# EAGLE design MyRIO_LickometerBreakout_Gamma1a (EAGLE 8.2.0)

## Sheet 1 of 2
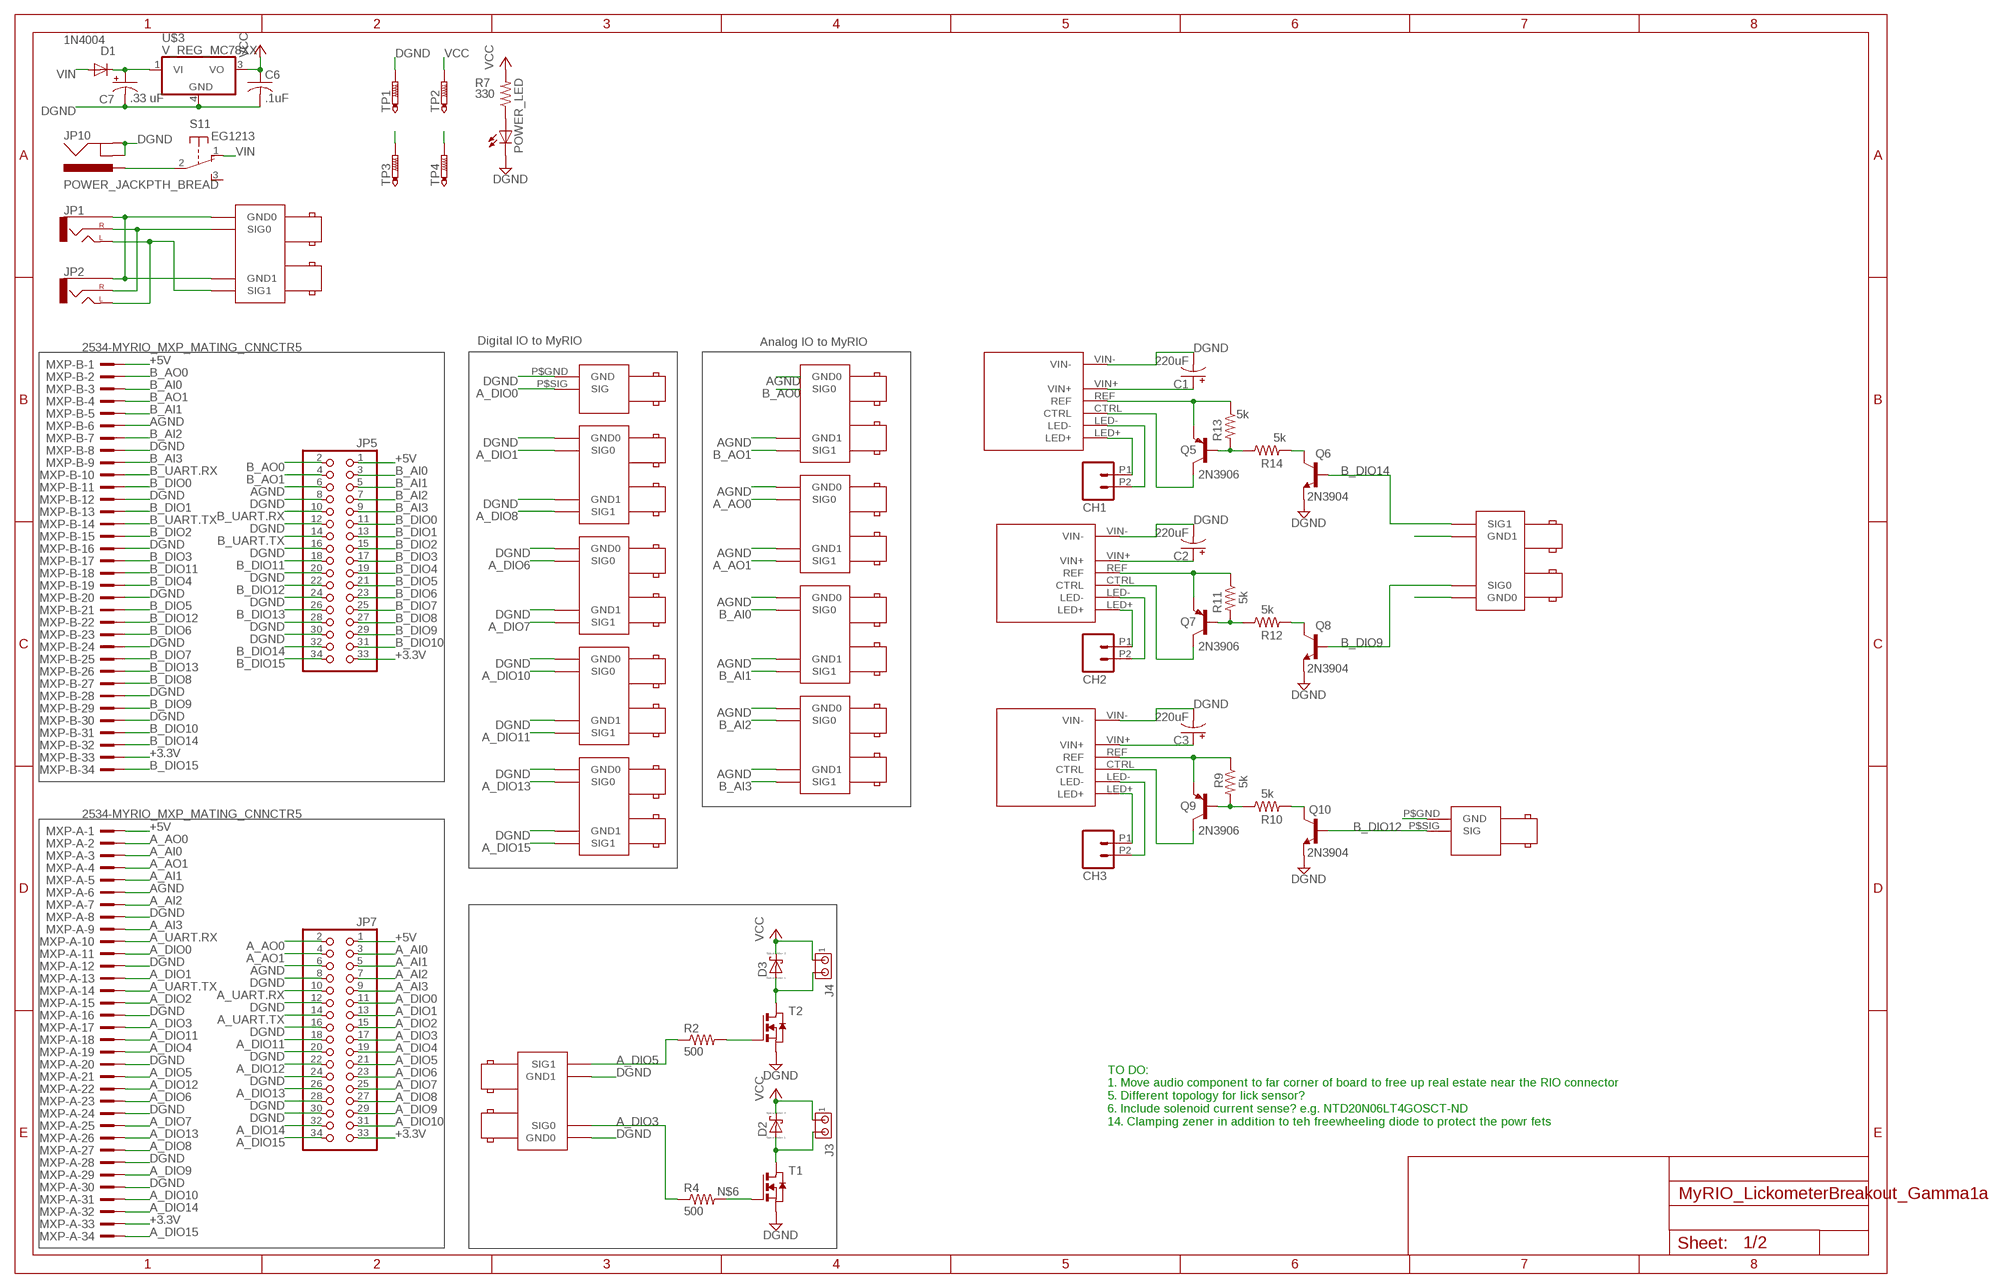
[diagram p0: schematic, sheet 1]

### Parts
AAO_0,1  BNC_RIGHT_ANGLE_DOUBLE  [BNC_RIGHT_ANGLE_DOUBLE]
ACTV_REC  BNC_RIGHT_ANGLE  [BNC_RIGHT_ANGLE]
AUDIO  BNC_RIGHT_ANGLE_DOUBLE  [BNC_RIGHT_ANGLE_DOUBLE]
BAI_0,1  BNC_RIGHT_ANGLE_DOUBLE  [BNC_RIGHT_ANGLE_DOUBLE]
BAI_2,3  BNC_RIGHT_ANGLE_DOUBLE  [BNC_RIGHT_ANGLE_DOUBLE]
BAO_0,1  BNC_RIGHT_ANGLE_DOUBLE  [BNC_RIGHT_ANGLE_DOUBLE]
BUCKPUCK1  BUCKPUCK-350-I  [BUCKPUCK_I]
BUCKPUCK2  BUCKPUCK-350-I  [BUCKPUCK_I]
BUCKPUCK3  BUCKPUCK-350-I  [BUCKPUCK_I]
C1  220uF  CPOL-USE5-10.5  [E5-10,5]
C2  220uF  CPOL-USE5-10.5  [E5-10,5]
C3  220uF  CPOL-USE5-10.5  [E5-10,5]
C6  .1uF  C-USC0805  [C0805]
C7  .33 uF  CPOL-USE2.5-5  [E2,5-5]
CAMERA  BNC_RIGHT_ANGLE_DOUBLE  [BNC_RIGHT_ANGLE_DOUBLE]
CH1  M022.54MM_SCREWTERM  [1X02_2.54_SCREWTERM]
CH2  M022.54MM_SCREWTERM  [1X02_2.54_SCREWTERM]
CH3  M022.54MM_SCREWTERM  [1X02_2.54_SCREWTERM]
D1  1N4004  [DO41-10]
D2  SCHOTTKY-DIODE  [DIODE_SMB]
D3  SCHOTTKY-DIODE  [DIODE_SMB]
D_FREE1_2  BNC_RIGHT_ANGLE_DOUBLE  [BNC_RIGHT_ANGLE_DOUBLE]
D_FREE3_4  BNC_RIGHT_ANGLE_DOUBLE  [BNC_RIGHT_ANGLE_DOUBLE]
J3  MTA02-100  [10X02MTA]
J4  MTA02-100  [10X02MTA]
JP1  AUDIO-JACKPTH  [AUDIO-JACK]
JP2  AUDIO-JACKPTH  [AUDIO-JACK]
JP5  PINHD-2X17  [2X17]
JP7  PINHD-2X17  [2X17]
JP10  POWER_JACKPTH_BREAD  [POWER_JACK_PTH_BREAD]
LED_CUE  BNC_RIGHT_ANGLE  [BNC_RIGHT_ANGLE]
LED_MASK  BNC_RIGHT_ANGLE_DOUBLE  [BNC_RIGHT_ANGLE_DOUBLE]
MXP-A  2534-MYRIO_MXP_MATING_CNNCTR5  [PAK100/2500-5-34-MXP_CONNCTR]
MXP-B  2534-MYRIO_MXP_MATING_CNNCTR5  [PAK100/2500-5-34-MXP_CONNCTR]
POWER_LED  LED3MM  [LED3MM]
Q5  2N3906  MMBT3906LT1-PNP-SOT23-BEC  [SOT23-BEC]
Q6  2N3904  MMBT3904LT1-NPN-SOT23-BEC  [SOT23-BEC]
Q7  2N3906  MMBT3906LT1-PNP-SOT23-BEC  [SOT23-BEC]
Q8  2N3904  MMBT3904LT1-NPN-SOT23-BEC  [SOT23-BEC]
Q9  2N3906  MMBT3906LT1-PNP-SOT23-BEC  [SOT23-BEC]
Q10  2N3904  MMBT3904LT1-NPN-SOT23-BEC  [SOT23-BEC]
R2  500  R-US_M1206  [M1206]
R4  500  R-US_M1206  [M1206]
R7  330  RESISTOR_SM0805S  [0805S]
R9  5k  RESISTOR_SM0805S  [0805S]
R10  5k  RESISTOR_SM0805S  [0805S]
R11  5k  RESISTOR_SM0805S  [0805S]
R12  5k  RESISTOR_SM0805S  [0805S]
R13  5k  RESISTOR_SM0805S  [0805S]
R14  5k  RESISTOR_SM0805S  [0805S]
S1  EG1213  [EG1213]
SHUTTER  BNC_RIGHT_ANGLE_DOUBLE  [BNC_RIGHT_ANGLE_DOUBLE]
SLN  BNC_RIGHT_ANGLE_DOUBLE  [BNC_RIGHT_ANGLE_DOUBLE]
T1  NMOSSOT223  [SOT223]
T2  NMOSSOT223  [SOT223]
TP1  PTR1PAD1-17Y  [P1-17Y]
TP2  PTR1PAD1-17Y  [P1-17Y]
TP3  PTR1PAD1-17Y  [P1-17Y]
TP4  PTR1PAD1-17Y  [P1-17Y]
U$3  V_REG_MC78XX  [DPAK]

### Nets
+3.3V: JP5.33 JP7.33 MXP-A.33 MXP-B.33
+5V: JP5.1 JP7.1 MXP-A.1 MXP-B.1 ; also sheet 2
+9V: TP4.TP ; also sheet 2
A_AI0: JP7.3 MXP-A.3
A_AI1: JP7.5 MXP-A.5
A_AI2: JP7.7 MXP-A.7
A_AI3: JP7.9 MXP-A.9
A_AO0: AAO_0,1.P$SIG0(SIG0) JP7.2 MXP-A.2
A_AO1: AAO_0,1.P$SIG1(SIG1) JP7.4 MXP-A.4
A_DIO0: ACTV_REC.P$SIG(SIG) JP7.11 MXP-A.11
A_DIO1: CAMERA.P$SIG0(SIG0) JP7.13 MXP-A.13
A_DIO2: JP7.15 MXP-A.15 ; also sheet 2
A_DIO3: JP7.17 MXP-A.17 R4.1 SLN.P$SIG0(SIG0)
A_DIO4: JP7.19 MXP-A.19 ; also sheet 2
A_DIO5: JP7.21 MXP-A.21 R2.1 SLN.P$SIG1(SIG1)
A_DIO6: JP7.23 MXP-A.23 SHUTTER.P$SIG0(SIG0)
A_DIO7: JP7.25 MXP-A.25 SHUTTER.P$SIG1(SIG1)
A_DIO8: CAMERA.P$SIG1(SIG1) JP7.27 MXP-A.27
A_DIO9: JP7.29 MXP-A.29
A_DIO10: D_FREE1_2.P$SIG0(SIG0) JP7.31 MXP-A.31
A_DIO11: D_FREE1_2.P$SIG1(SIG1) JP7.18 MXP-A.18
A_DIO12: JP7.22 MXP-A.22
A_DIO13: D_FREE3_4.P$SIG0(SIG0) JP7.26 MXP-A.26
A_DIO14: JP7.32 MXP-A.32
A_DIO15: D_FREE3_4.P$SIG1(SIG1) JP7.34 MXP-A.34
A_UART.RX: JP7.10 MXP-A.10
A_UART.TX: JP7.14 MXP-A.14
AGND: AAO_0,1.P$GND0(GND0) AAO_0,1.P$GND1(GND1) BAI_0,1.P$GND0(GND0) BAI_0,1.P$GND1(GND1) BAI_2,3.P$GND0(GND0) BAI_2,3.P$GND1(GND1) BAO_0,1.P$GND0(GND0) BAO_0,1.P$GND1(GND1) JP5.6 JP7.6 MXP-A.6 MXP-B.6
B_AI0: BAI_0,1.P$SIG0(SIG0) JP5.3 MXP-B.3
B_AI1: BAI_0,1.P$SIG1(SIG1) JP5.5 MXP-B.5
B_AI2: BAI_2,3.P$SIG0(SIG0) JP5.7 MXP-B.7
B_AI3: BAI_2,3.P$SIG1(SIG1) JP5.9 MXP-B.9
B_AO0: BAO_0,1.P$SIG0(SIG0) JP5.2 MXP-B.2
B_AO1: BAO_0,1.P$SIG1(SIG1) JP5.4 MXP-B.4
B_DIO0: JP5.11 MXP-B.11
B_DIO1: JP5.13 MXP-B.13
B_DIO2: JP5.15 MXP-B.15
B_DIO3: JP5.17 MXP-B.17
B_DIO4: JP5.19 MXP-B.19
B_DIO5: JP5.21 MXP-B.21
B_DIO6: JP5.23 MXP-B.23
B_DIO7: JP5.25 MXP-B.25
B_DIO8: JP5.27 MXP-B.27
B_DIO9: JP5.29 LED_MASK.P$SIG0(SIG0) MXP-B.29 Q8.B
B_DIO10: JP5.31 MXP-B.31
B_DIO11: JP5.18 MXP-B.18
B_DIO12: JP5.22 LED_CUE.P$SIG(SIG) MXP-B.22 Q10.B
B_DIO13: JP5.26 MXP-B.26
B_DIO14: JP5.32 LED_MASK.P$SIG1(SIG1) MXP-B.32 Q6.B
B_DIO15: JP5.34 MXP-B.34
B_UART.RX: JP5.10 MXP-B.10
B_UART.TX: JP5.14 MXP-B.14
BCKPCK_CTRL2: Q8.C R12.2
BCKPCK_CTRL3: Q10.C R10.2
CTRL1: BUCKPUCK1.CTRL Q5.C
CTRL2: BUCKPUCK2.CTRL Q7.C
CTRL3: BUCKPUCK3.CTRL Q9.C
DGND: ACTV_REC.P$GND(GND) BUCKPUCK1.LED- BUCKPUCK1.VIN- BUCKPUCK2.LED- BUCKPUCK2.VIN- BUCKPUCK3.LED- BUCKPUCK3.VIN- C1.- C2.- C3.- C6.2 C7.- CAMERA.P$GND0(GND0) CAMERA.P$GND1(GND1) CH1.P2 CH2.P2 CH3.P2 D_FREE1_2.P$GND0(GND0) D_FREE1_2.P$GND1(GND1) D_FREE3_4.P$GND0(GND0) D_FREE3_4.P$GND1(GND1) JP5.8 JP5.12 JP5.16 JP5.20 JP5.24 JP5.28 JP5.30 JP7.8 JP7.12 JP7.16 JP7.20 JP7.24 JP7.28 JP7.30 JP10.GND JP10.GNDBREAK LED_CUE.P$GND(GND) LED_MASK.P$GND0(GND0) LED_MASK.P$GND1(GND1) MXP-A.8 MXP-A.12 MXP-A.16 MXP-A.20 MXP-A.24 MXP-A.28 MXP-A.30 MXP-B.8 MXP-B.12 MXP-B.16 MXP-B.20 MXP-B.24 MXP-B.28 MXP-B.30 POWER_LED.K(C) Q6.E Q8.E Q10.E SHUTTER.P$GND0(GND0) SHUTTER.P$GND1(GND1) SLN.P$GND0(GND0) SLN.P$GND1(GND1) T1.3(S) T2.3(S) TP1.TP U$3.4(GND) ; also sheet 2
GND-ISO: TP3.TP ; also sheet 2
LED3+: BUCKPUCK3.LED+ CH3.P1
N$2: R2.2 T2.1(G)
N$3: AUDIO.P$GND0(GND0) AUDIO.P$GND1(GND1) JP1.SLEEVE JP2.SLEEVE
N$4: AUDIO.P$SIG0(SIG0) JP1.RING(RIGHT) JP2.RING(RIGHT)
N$5: AUDIO.P$SIG1(SIG1) JP1.TIP(LEFT) JP2.TIP(LEFT)
N$6: R4.2 T1.1(G)
N$11: BUCKPUCK3.REF Q9.E R9.1
N$13: BUCKPUCK1.LED+ CH1.P1
N$15: Q9.B R9.2 R10.1
N$16: BUCKPUCK1.VIN+ BUCKPUCK2.VIN+ BUCKPUCK3.VIN+ C1.+ C2.+ C3.+ C7.+ D1.C U$3.1(VI)
N$20: BUCKPUCK2.LED+ CH2.P1
N$21: POWER_LED.A R7.1
N$22: BUCKPUCK1.REF Q5.E R13.1
N$24: BUCKPUCK2.REF Q7.E R11.1
N$29: Q5.B R13.2 R14.1
N$33: Q7.B R11.2 R12.1
N$36: JP10.PWR S1.2(1:P)
N$42: Q6.C R14.2
VCC: C6.1 D2.C(A) D3.C(A) J3.1 J4.1 R7.2 TP2.TP U$3.3(VO)
VIN: D1.A S1.1(1:O)
VOUT-1: D2.A(C) J3.2 T1.2(D) T1.4(D)
VOUT-2: D3.A(C) J4.2 T2.2(D) T2.4(D)
Unconnected: S1.3(1:S) S1.MT1(MT) S1.MT2(MT)

### Notes on the sheet
- Digital IO to MyRIO | Analog IO to MyRIO
- TO DO:
  1. Move audio component to far corner of board to free up real estate near the RIO connector
  5. Different topology for lick sensor?
  6. Include solenoid current sense? e.g. NTD20N06LT4GOSCT-ND
  14. Clamping zener in addition to teh freewheeling diode to protect the powr fets

## Sheet 2 of 2
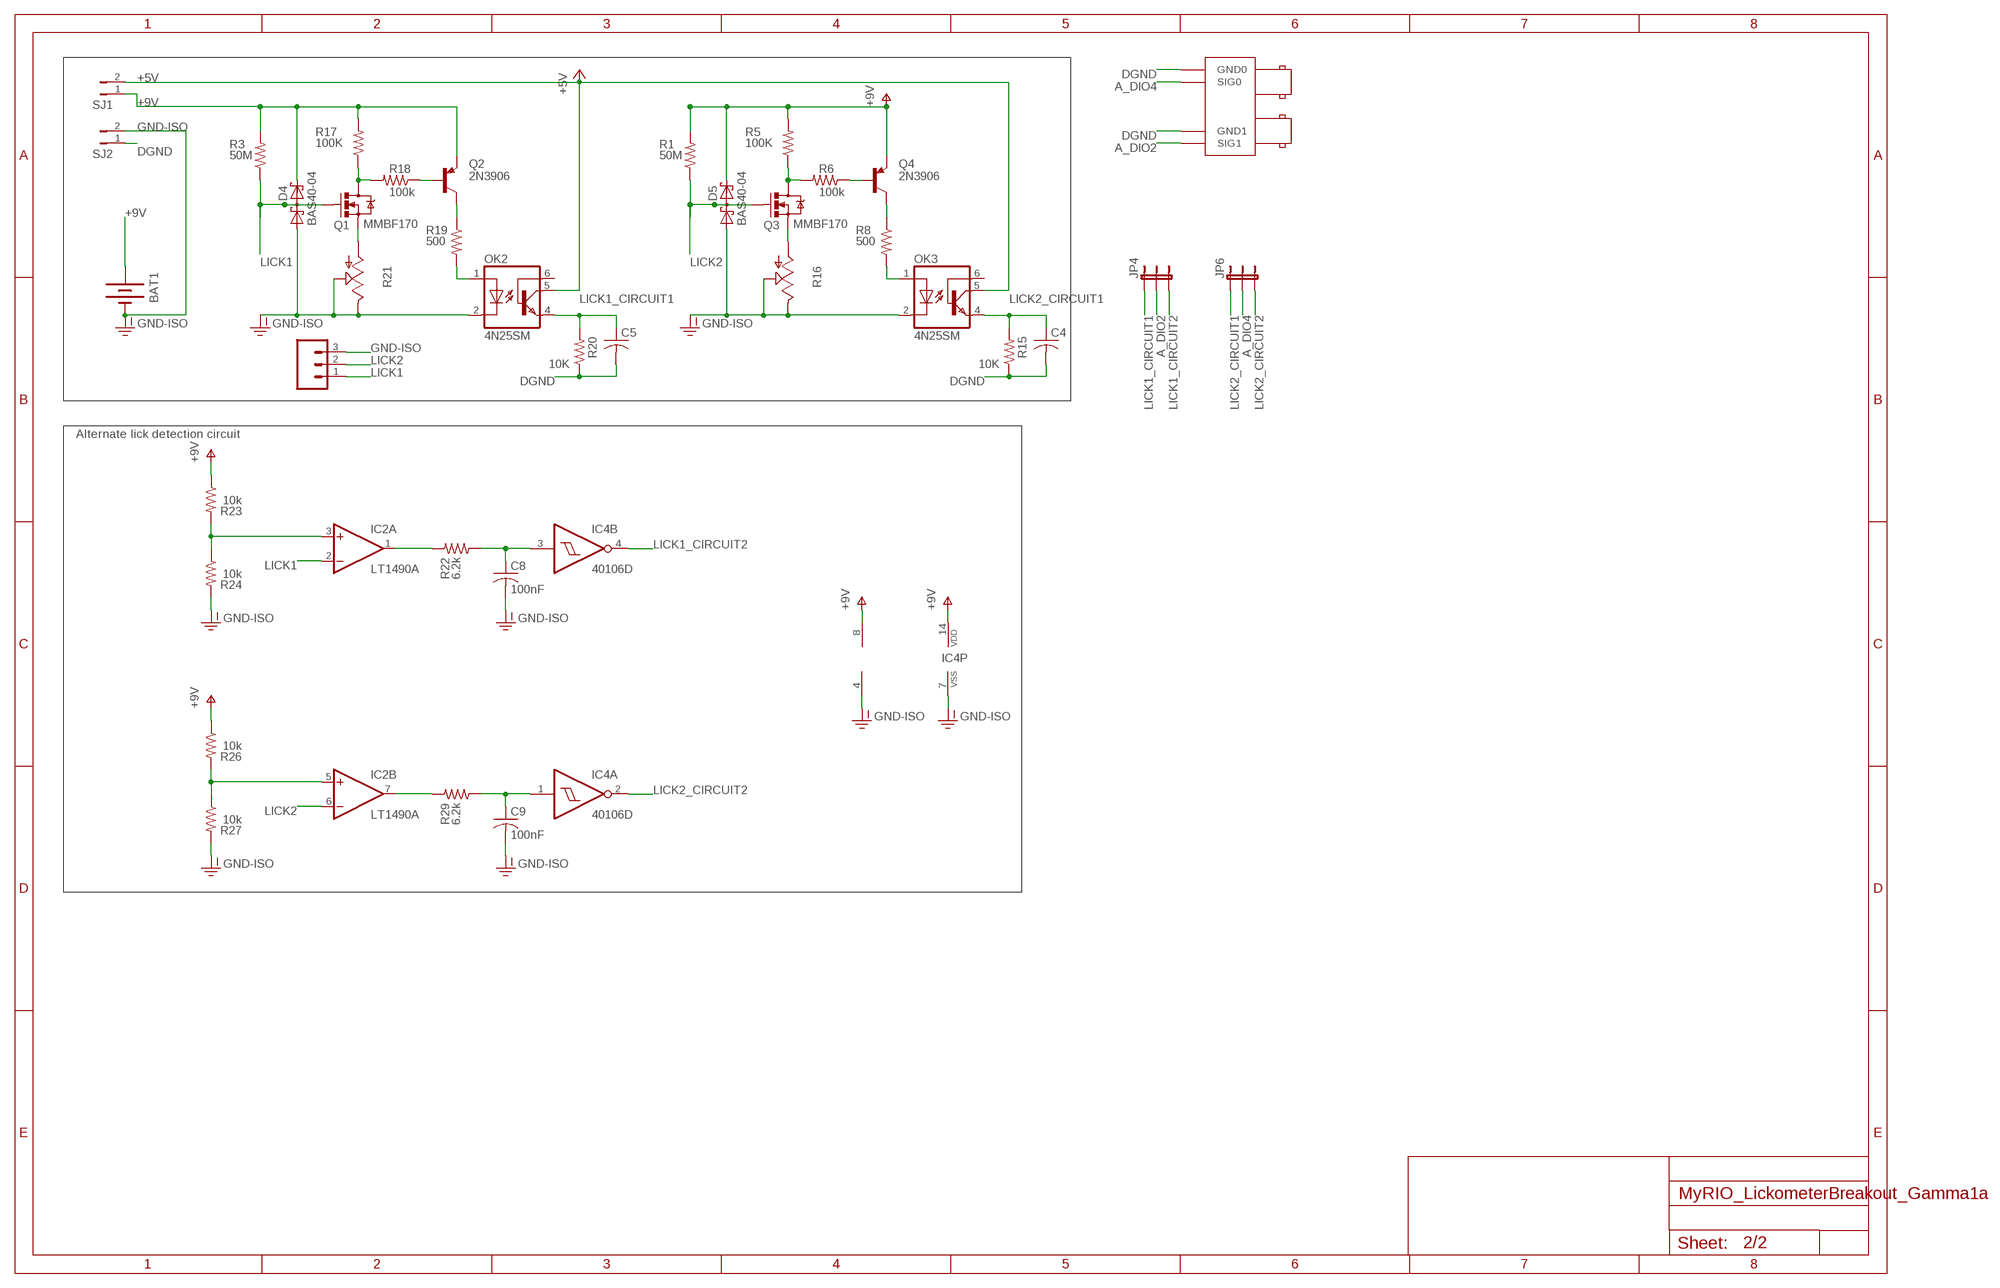
[diagram p1: schematic, sheet 2]

### Parts
BAT1  BATTERY9V  [BATTCON_9V]
C4  C-US025-024X044  [C025-024X044]
C5  C-US025-024X044  [C025-024X044]
C8  100nF  C-USC0805  [C0805]
C9  100nF  C-USC0805  [C0805]
D4  BAS40-04  [SOT23]
D5  BAS40-04  [SOT23]
IC2  LT1490A  LM393D  [SO08]
IC4  40106D  [SO14]
JP4  JUMPER-3PTH  [1X03]
JP6  JUMPER-3PTH  [1X03]
JP11  M03POLAR  [MOLEX-1X3]
LICK  BNC_RIGHT_ANGLE_DOUBLE  [BNC_RIGHT_ANGLE_DOUBLE]
OK2  4N25SM  [DIL6-SMD]
OK3  4N25SM  [DIL6-SMD]
Q1  MMBF170  MOSFET-NCHANNELAO3404A  [SOT23-3]
Q2  2N3906  MMBT3906LT1-PNP-SOT23-BEC  [SOT23-BEC]
Q3  MMBF170  MOSFET-NCHANNELAO3404A  [SOT23-3]
Q4  2N3906  MMBT3906LT1-PNP-SOT23-BEC  [SOT23-BEC]
R1  50M  RESISTOR_SM0805S  [0805S]
R3  50M  RESISTOR_SM0805S  [0805S]
R5  100K  RESISTOR_SM0805S  [0805S]
R6  100k  RESISTOR_SM0805S  [0805S]
R8  500  RESISTOR_SM0805S  [0805S]
R15  10K  RESISTOR_SM0805S  [0805S]
R16  TRIM_US-B25P  [B25P]
R17  100K  RESISTOR_SM0805S  [0805S]
R18  100k  RESISTOR_SM0805S  [0805S]
R19  500  RESISTOR_SM0805S  [0805S]
R20  10K  RESISTOR_SM0805S  [0805S]
R21  TRIM_US-B25P  [B25P]
R22  6.2k  RESISTOR_SM0805S  [0805S]
R23  10k  RESISTOR_SM0805S  [0805S]
R24  10k  RESISTOR_SM0805S  [0805S]
R26  10k  RESISTOR_SM0805S  [0805S]
R27  10k  RESISTOR_SM0805S  [0805S]
R29  6.2k  RESISTOR_SM0805S  [0805S]
SJ1  JUMPER-PTH-2-NO  [PTH-JUMPER-2-NO_NO_SILK]
SJ2  JUMPER-PTH-2-NO  [PTH-JUMPER-2-NO_NO_SILK]

### Nets
+5V: OK2.5(COL) OK3.5(COL) SJ1.2 ; also sheet 1
+9V: BAT1.+ D4.2(C2) D5.2(C2) IC2.8(P:V+) IC4.14(P:VDD) Q2.E Q4.E R1.2 R3.2 R5.2 R17.2 R23.1 R26.1 SJ1.1 ; also sheet 1
A_DIO2: JP4.2 LICK.P$SIG1(SIG1) ; also sheet 1
A_DIO4: JP6.2 LICK.P$SIG0(SIG0) ; also sheet 1
DGND: C4.2 C5.2 LICK.P$GND0(GND0) LICK.P$GND1(GND1) R15.1 R20.1 SJ2.1 ; also sheet 1
GND-ISO: BAT1.- C8.2 C9.2 D4.1(A1) D5.1(A1) IC2.4(P:V-) IC4.7(P:VSS) JP11.3 OK2.2(C) OK3.2(C) R16.E R16.S R21.E R21.S R24.2 R27.2 SJ2.2 ; also sheet 1
LICK1: D4.3(C1A2) IC2.2(A:-IN) JP11.1 Q1.1(G) R3.1
LICK1_CIRCUIT1: C5.1 JP4.1 OK2.4(EMI) R20.2
LICK1_CIRCUIT2: IC4.4(B:O) JP4.3
LICK2: D5.3(C1A2) IC2.6(B:-IN) JP11.2 Q3.1(G) R1.1
LICK2_CIRCUIT1: C4.1 JP6.1 OK3.4(EMI) R15.2
LICK2_CIRCUIT2: IC4.2(A:O) JP6.3
N$1: Q1.3(D) R17.1 R18.2
N$7: Q3.3(D) R5.1 R6.2
N$8: Q4.B R6.1
N$9: OK3.1(A) R8.2
N$10: Q4.C R8.1
N$12: Q3.2(S) R16.A
N$14: Q2.B R18.1
N$17: OK2.1(A) R19.2
N$18: Q2.C R19.1
N$19: Q1.2(S) R21.A
N$23: C8.1 IC4.3(B:I) R22.1
N$25: IC2.1(A:OUT) R22.2
N$26: IC2.3(A:+IN) R23.2 R24.1
N$31: IC2.5(B:+IN) R26.2 R27.1
N$34: C9.1 IC4.1(A:I) R29.1
N$35: IC2.7(B:OUT) R29.2
Unconnected: IC4.5(C:I) IC4.6(C:O) IC4.8(D:O) IC4.9(D:I) IC4.10(E:O) IC4.11(E:I) IC4.12(F:O) IC4.13(F:I) OK2.6(BAS) OK3.6(BAS)

### Notes on the sheet
- Alternate lick detection circuit

## Library data of the parts
AAO_0,1 AUDIO BAI_0,1 BAI_2,3 BAO_0,1 CAMERA D_FREE1_2 D_FREE3_4 LED_MASK LICK SHUTTER SLN = Pavel_Connectors:BNC_RIGHT_ANGLE_DOUBLE
ACTV_REC LED_CUE = connectors:BNC_RIGHT_ANGLE: BNC plug, through-hole, right-angle
BAT1 = Pavel_ElectroMechanical:BATTERY: Battery Holders Various common sizes : AA, AAA, 18650 (PRT-12895), 20mm coin cell and 12mm coin cell. 20MM_4LEGS, BATT-10373 9V Digikey BH9v-PC-ND
BUCKPUCK1-BUCKPUCK3 = Pavel-PowerIC:BUCKPUCK-*-?
C1-C3 C7 = adafruit:CPOL-US: POLARIZED CAPACITOR, American symbol
C4-C6 C8 C9 = adafruit:C-US: CAPACITOR, American symbol
CH1-CH3 = SparkFun-Connectors:M02: Standard 2-pin 0.1" header. Use with - straight break away headers ( PRT-00116) - right angle break away headers (PRT-00553) - swiss pins (PRT-00743) - machine pins (PRT-00117) - female headers (PRT-00115) Molex polarized connector foot print use with: PRT-08233 with associated crimp pins and housings. 2.54_SCREWTERM for use with PRT-10571. 3.5mm Screw Terminal footprints for PRT-08084 5mm Screw Terminal footprints for use with PRT-08432
D1 = adafruit:1N4004: DIODE General purpose 1N400x type rectifier (With bigger pads) http://www.ladyada.net/library/pcb/eaglelibrary.html
D2 D3 = eagle-ltspice:SCHOTTKY-DIODE: Schottky Diode; SPICEMODEL: NONE; SPICEPREFIX: D; SPICETYPE: diode
D4 D5 = diode:BAS40-04: Silicon Schottky Diodes General-purpose diode for high-speed switching
IC2 = linear:LM393: COMPARATOR
IC4 = 40xx:40106: Hex SCHMITT TRIGGER
J3 J4 = con-amp:MTA02-100: AMP connector
JP1 JP2 = SparkFun-Connectors:AUDIO-JACK: 3.5mm Audio Jack Simple 3.5mm common PCB mount audio jack. Variant PTH is our storefront SKU PRT-08032
JP4 JP6 = SparkFun-Retired:JUMPER-3
JP5 JP7 = pinhead:PINHD-2X17: PIN HEADER
JP10 = SparkFun-Connectors:POWER_JACK: Power Jack Connector This is the standard 5.5mm barrel jack for power. The PTH is the most common, proven, reliable, footprint. The Slot footprint only works if the mill layer is transmitted to the PCB fab house so be warned. Here are the connectors we sell at SparkFun: DC Barrel Power Jack/Connector <https://www.sparkfun.com/products/119> (PRT-00119) DC Barrel Power Jack/Connector (SMD) <https://www.sparkfun.com/products/12748> (PRT-12748) DC Barrel Jack Adapter - Breadboard Compatible <https://www.sparkfun.com/products/10811> (PRT-10811) It is used on this SparkFun product (and many, many others): SparkFun RedBoard - Programmed with Arduino <https://www.sparkfun.com/products/12757> (DEV-12757) Also, if you need a mating power supply or connector, please check these out: Wall Adapter Power Supply - 9VDC 650mA <https://www.sparkfun.com/products/298> (TOL-00298) DC Barrel Jack Adapter - Male <https://www.sparkfun.com/products/10287> (PRT-10287); PROD_ID: PRT-10811
JP11 = SparkFun:M03: Header 3 Standard 3-pin 0.1" header. Use with straight break away headers (SKU : PRT-00116), right angle break away headers (PRT-00553), swiss pins (PRT-00743), machine pins (PRT-00117), and female headers (PRT-00115). Molex polarized connector foot print use with SKU : PRT-08232 with associated crimp pins and housings.
MXP-A MXP-B = Pavel_ElectroMechanical:2534-MYRIO_MXP_MATING_CNNCTR: 3M (TM) Pak 100 4-Wall Header Source: 3M; OC_FARNELL: 9838406; OC_NEWARK: unknown
OK2 OK3 = optocoupler:4N*?M: General Purpose 6-Pin Phototransistor Optocouplers Source: http://www.fairchildsemi.com/ds/4N/4N35-M.pdf; MF: FAIRCHILD SEMICONDUCTOR; MPN: 4N25SM; OC_FARNELL: 1021152; OC_NEWARK: 34C2020
POWER_LED = led:LED: LED OSRAM: - CHIPLED LG R971, LG N971, LY N971, LG Q971, LY Q971, LO R971, LY R971 LH N974, LH R974 LS Q976, LO Q976, LY Q976 LO Q996 - Hyper CHIPLED LW Q18S LB Q993, LB Q99A, LB R99A - SideLED LS A670, LO A670, LY A670, LG A670, LP A670 LB A673, LV A673, LT A673, LW A673 LH A674 LY A675 LS A676, LA A676, LO A676, LY A676, LW A676 LS A679, LY A679, LG A679 - Hyper Micro SIDELED® LS Y876, LA Y876, LO Y876, LY Y876 LT Y87S - SmartLED LW L88C, LW L88S LB L89C, LB L89S, LG L890 LS L89K, LO L89K, LY L89K LS L896, LA L896, LO L896, LY L896 - TOPLED LS T670, LO T670, LY T670, LG T670, LP T670 LSG T670, LSP T670, LSY T670, LOP T670, LYG T670 LG T671, LOG T671, LSG T671 LB T673, LV T673, LT T673, LW T673 LH T674 LS T676, LA T676, LO T676, LY T676, LB T676, LH T676, LSB T676, LW T676 LB T67C, LV T67C, LT T67C, LS T67K, LO T67K, LY T67K, LW E67C LS E67B, LA E67B, LO E67B, LY E67B, LB E67C, LV E67C, LT E67C LW T67C LS T679, LY T679, LG T679 LS T770, LO T770, LY T770, LG T770, LP T770 LB T773, LV T773, LT T773, LW T773 LH T774 LS E675, LA E675, LY E675, LS T675 LS T776, LA T776, LO T776, LY T776, LB T776 LHGB T686 LT T68C, LB T68C - Hyper Mini TOPLED® LB M676 - Mini TOPLED Santana® LG M470 LS M47K, LO M47K, LY M47K Source: http://www.osram.convergy.de LUXEON: - LUMILED® LXK2-PW12-R00, LXK2-PW12-S00, LXK2-PW14-U00, LXK2-PW14-V00 LXK2-PM12-R00, LXK2-PM12-S00, LXK2-PM14-U00 LXK2-PE12-Q00, LXK2-PE12-R00, LXK2-PE12-S00, LXK2-PE14-T00, LXK2-PE14-U00 LXK2-PB12-K00, LXK2-PB12-L00, LXK2-PB12-M00, LXK2-PB14-N00, LXK2-PB14-P00, LXK2-PB14-Q00 LXK2-PR12-L00, LXK2-PR12-M00, LXK2-PR14-Q00, LXK2-PR14-R00 LXK2-PD12-Q00, LXK2-PD12-R00, LXK2-PD12-S00 LXK2-PH12-R00, LXK2-PH12-S00 LXK2-PL12-P00, LXK2-PL12-Q00, LXK2-PL12-R00 Source: www.luxeon.com KINGBRIGHT: KA-3528ASYC Source: www.kingbright.com
Q1 Q3 = SparkFun-DiscreteSemi:MOSFET-NCHANNEL: Common NMOSFET Parts MFG P/N Store ID Prod ID FDD8780 TRANS-09984 SI7820DN TRANS-11055 FDS6630A IC-08089 2N7002PW TRANS-11151 FQP30N06L COM-10213 TRANS-10060 BSS123LT1G TRANS-08345 BSS138 TRANS-00830 BS170 2N7000; PROD_ID: TRAN-12988
Q2 Q4 Q5 Q7 Q9 = transistor:*-PNP-: PNP Transistror
Q6 Q8 Q10 = transistor-neu-to92:*-NPN-: NPN Transistror
R1 R3 R5-R15 R17-R20 R22-R24 R26 R27 R29 = SteveS:RESISTOR_SM
R2 R4 = adafruit:R-US_: RESISTOR, American symbol
R16 R21 = pot:TRIM_US-: POTENTIOMETER
S1 = adafruit:EG1213: E-Switch right-angle slide SPDT Part #EG1213 http://www.ladyada.net/library/eagle
SJ1 SJ2 = SparkFun-Passives:JUMPER-PTH-2-NO
T1 T2 = zetex:NMOSSOT223: MOS FET; OC_FARNELL: unknown; OC_NEWARK: unknown
TP1-TP4 = testpad:PTR1: TEST PIN
U$3 = Pavel-PowerIC:V_REG_MC78XX: DigiKey MC7815BD2TR4GOSDKR-ND TO-263-3, D2Pak, TO-263AB http://www.digikey.com/product-detail/en/MC7815BD2TR4G/MC7815BD2TR4GOSDKR-ND/3462629

## Net classes
1 power: width 0.508 mm

## Board
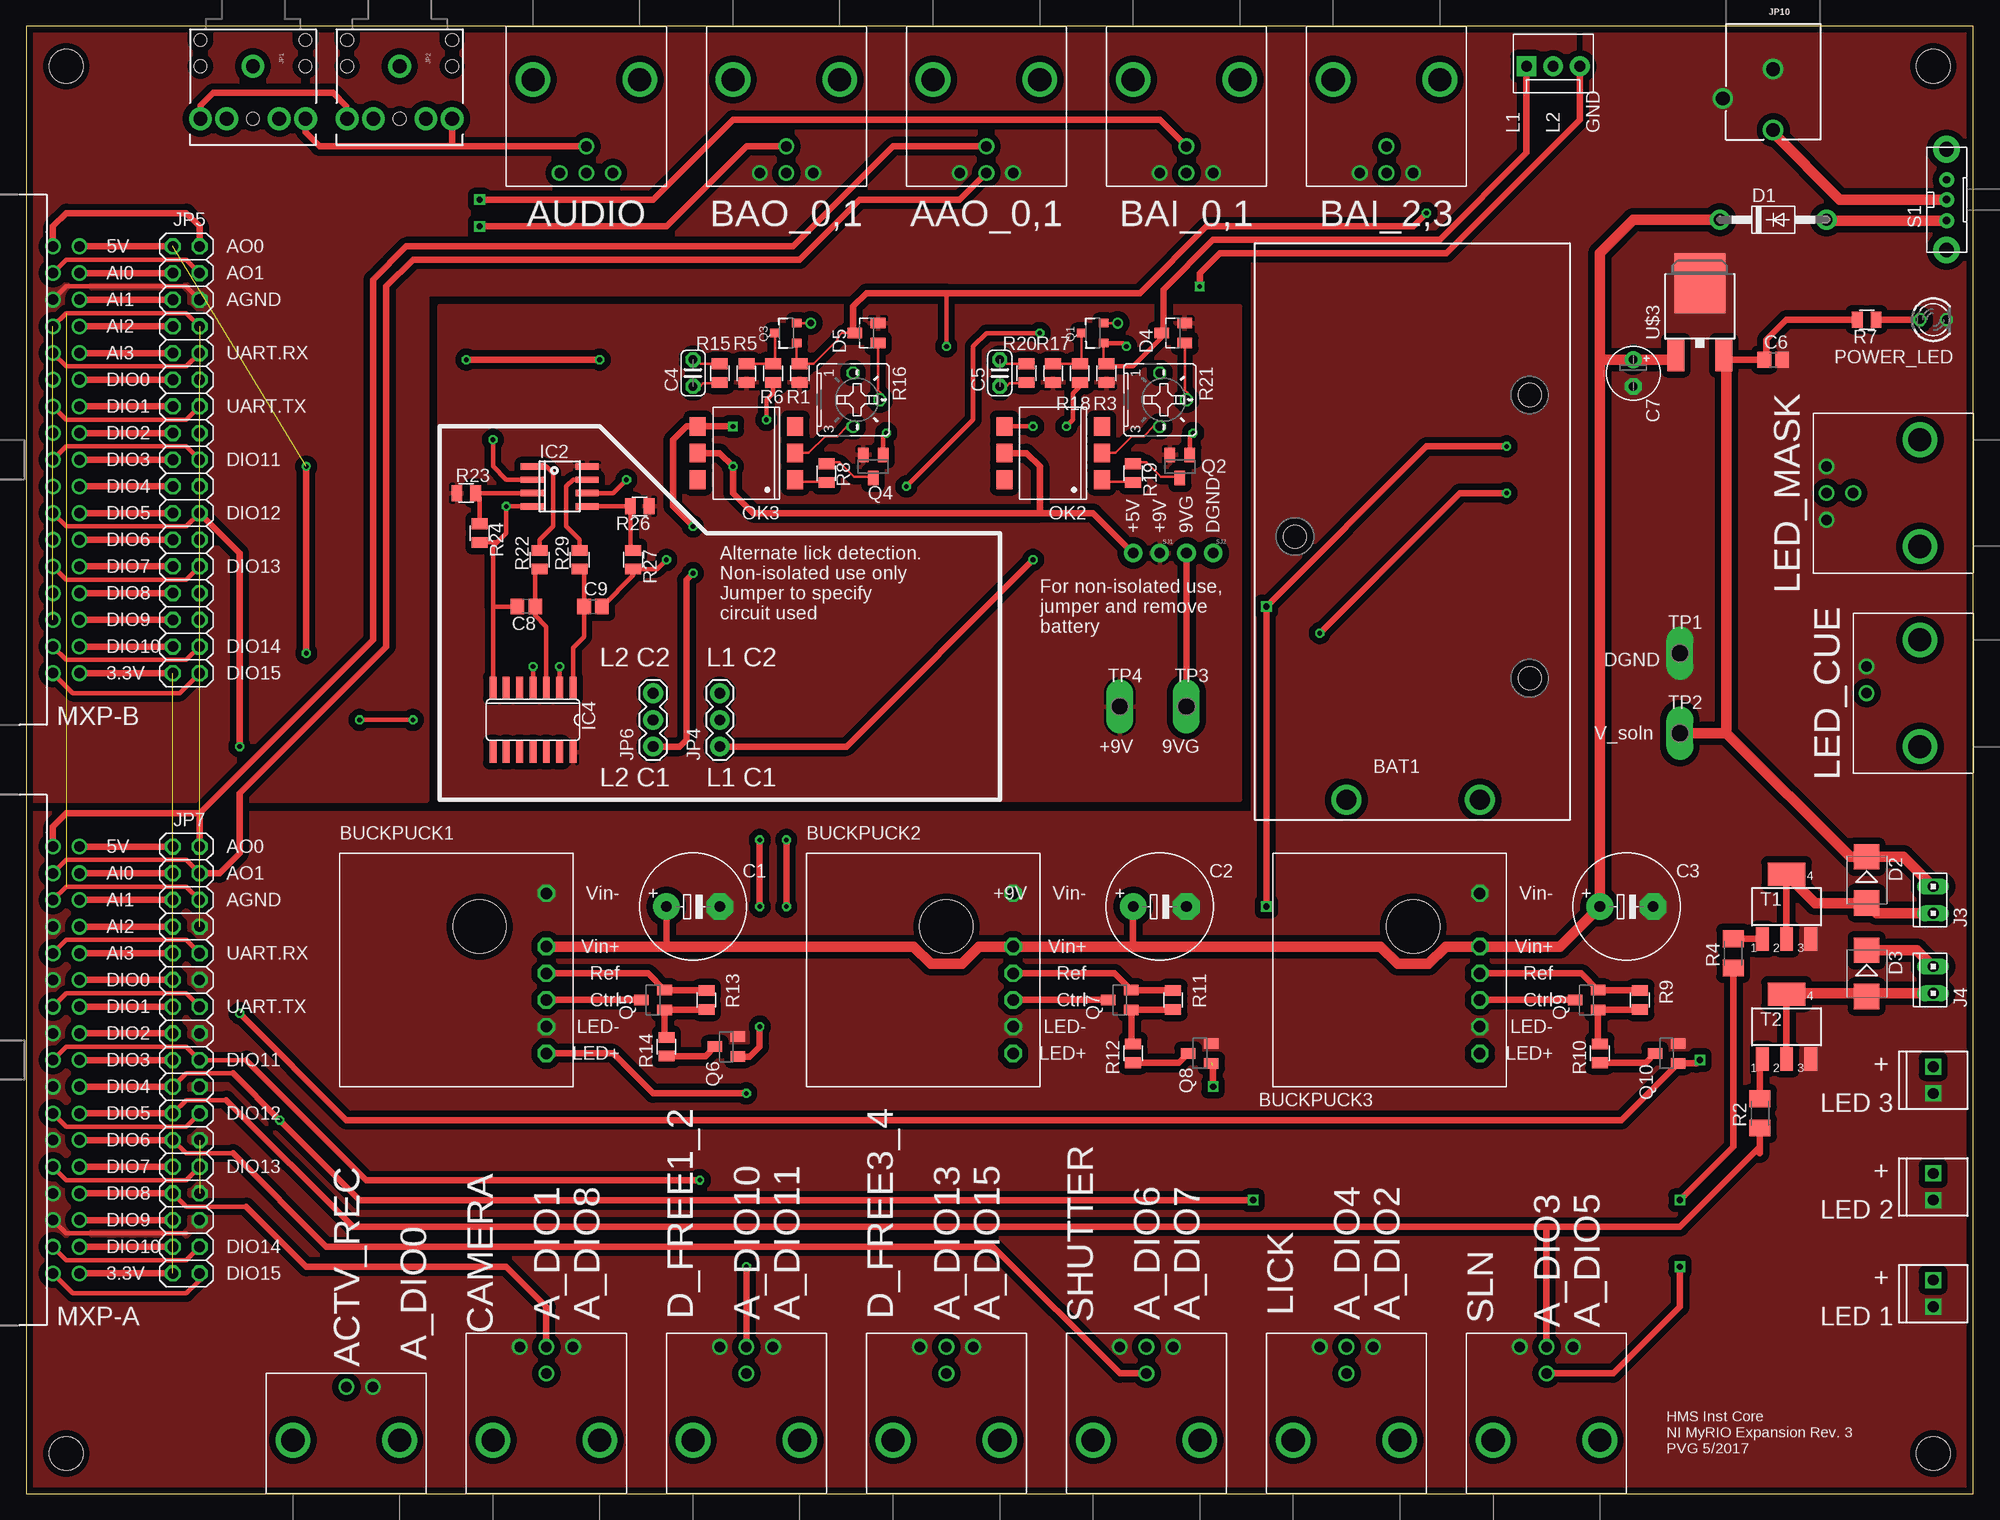
[diagram p2: board, top side]
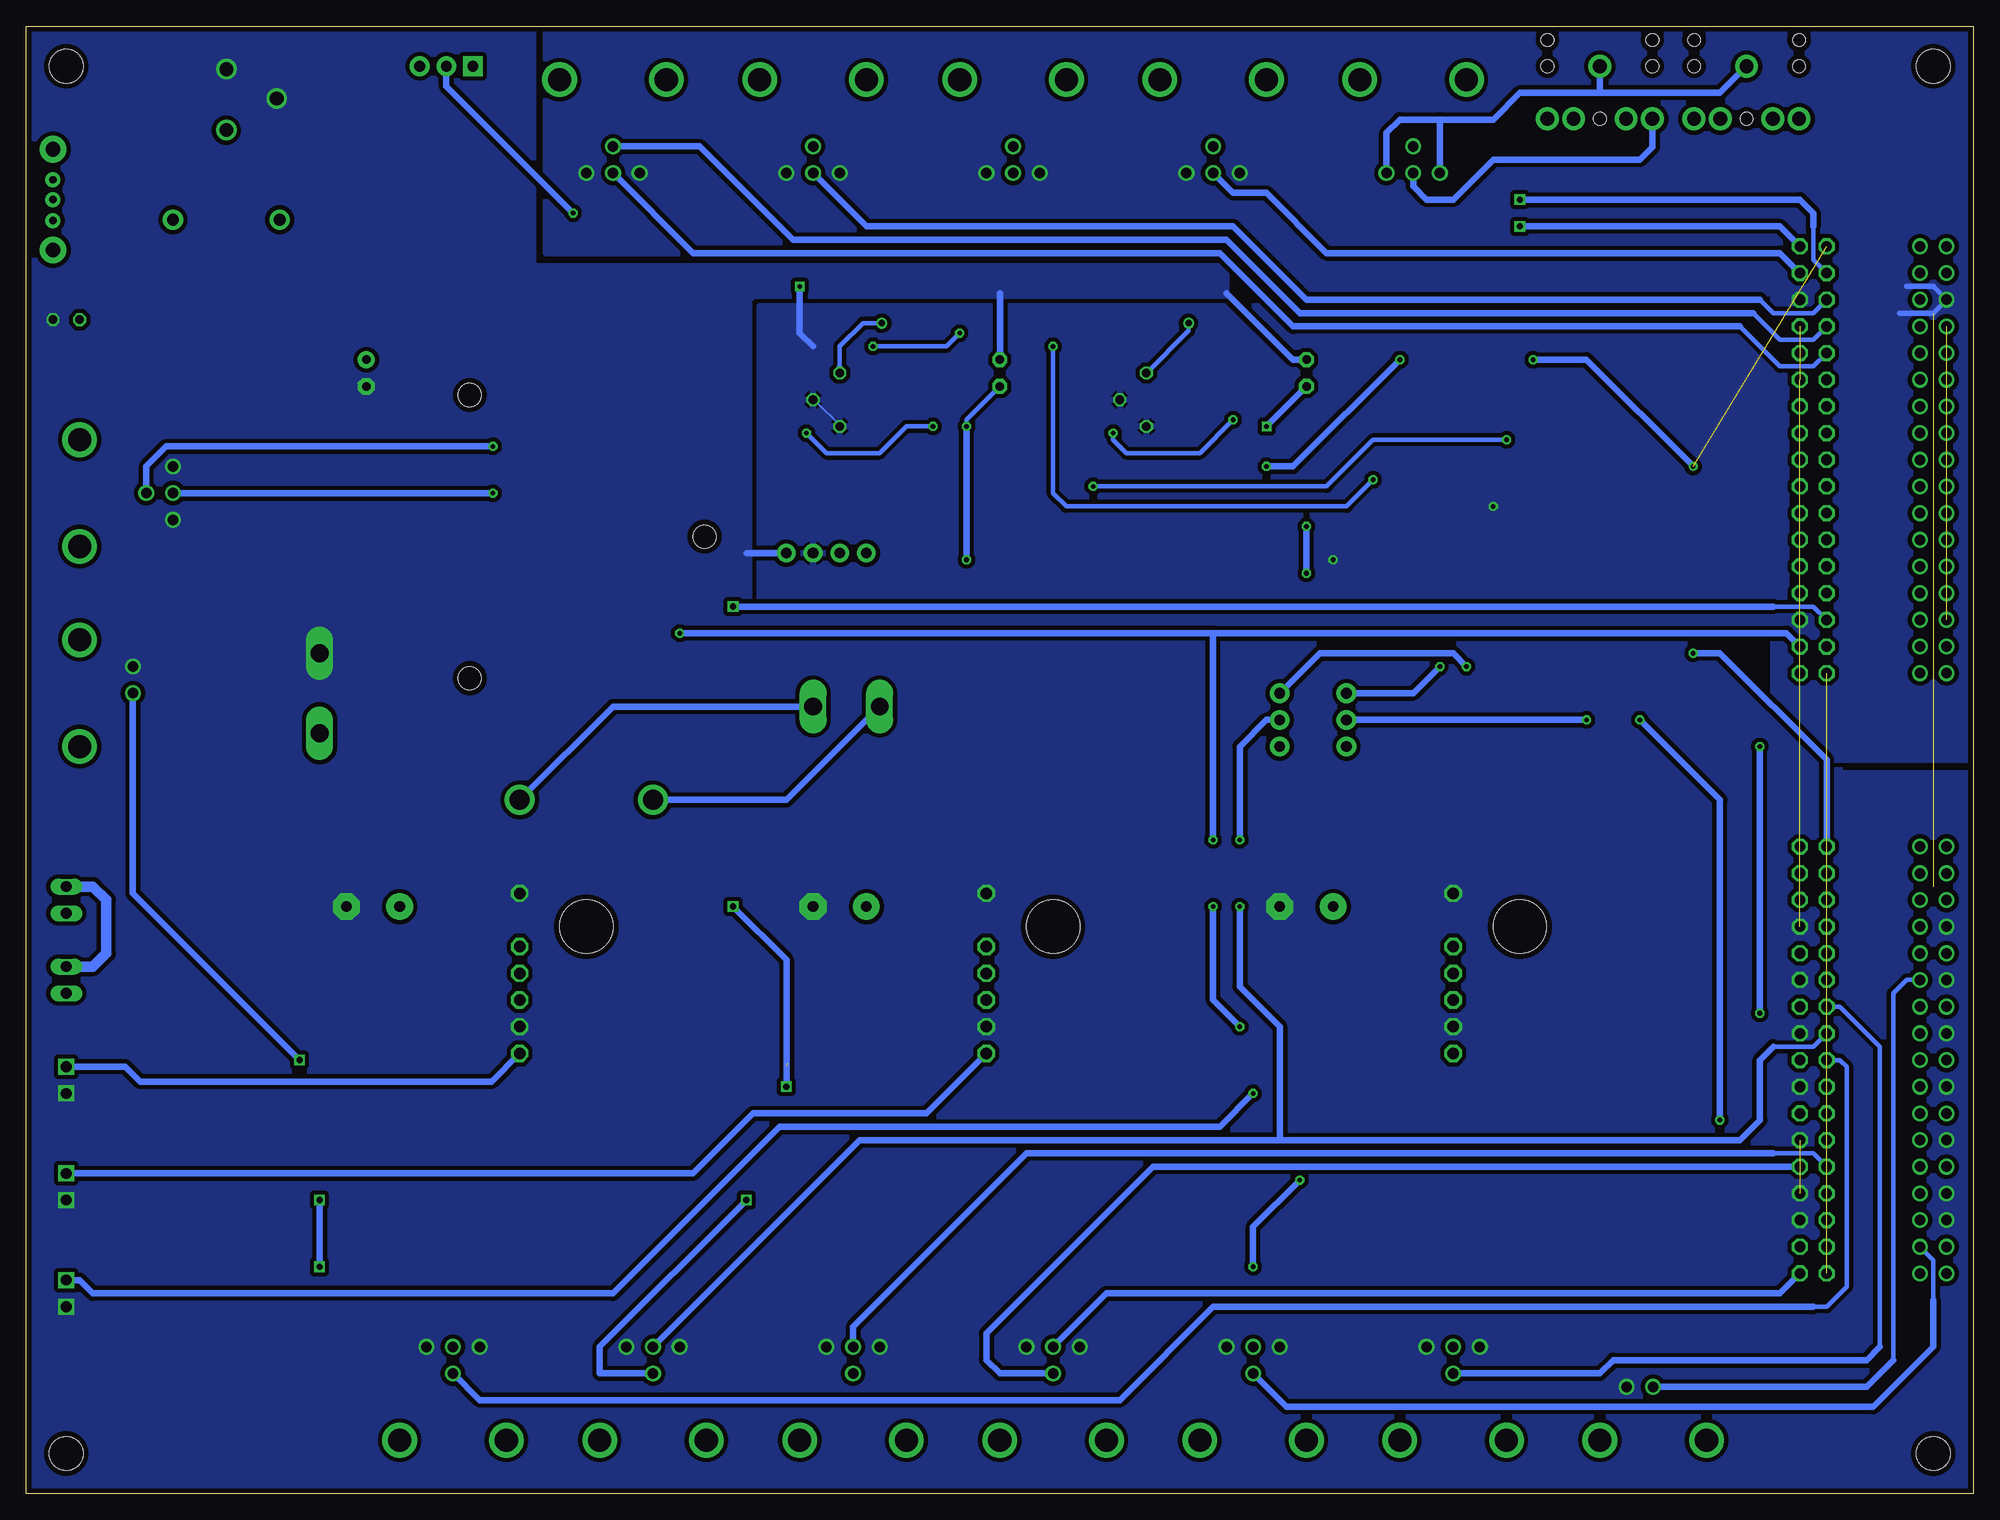
[diagram p3: board, bottom side, seen from below]

Size 185.42 x 139.7 mm. Coordinates in mm from the lower left corner, seen from the top.
Outline: 0,0 185.4,0 185.42,139.7 0,139.7 0,0
Copper layers (1*16): Top 0.0178mm / dielectric 59mil / Bottom 0.0178mm
Design rules "SSC-EAGLE-2Lyr_v1.0.0.3": minimum track width 6mil, minimum drill 14mil, track to track 6mil, track to pad 6mil, pad to pad 6mil, via to via 6mil, smd to smd 6mil, copper to edge 20mil, drill to drill 16mil, minimum pad ring 8mil, minimum via ring 8mil, stop-mask expansion 3mil, vias tented up to drill 0mil, thermal gap 10mil
Holes 3.2 mm at 3.81,3.81 181.61,3.81 181.61,135.89 3.81,135.89

### Footprints (pad centres in the part's own frame; a part is rotated, then mirrored left to right if it is on the bottom)
BNC_RIGHT_ANGLE_DOUBLE = drill 2.2: P$1 0,-5.08; P$2 0,5.08 | drill 1: P$GND0 8.89,-2.54; P$GND1 8.89,2.54; P$SIG0 6.35,0; P$SIG1 8.89,0
BNC_RIGHT_ANGLE = drill 2.2: P$1 -5.08,-6.35; P$2 5.08,-6.35 | drill 1: P$GND -2.54,-11.43; P$SIG 0,-11.43
BATTCON_9V = drill 1.905: + 0,-12.7; - 0,0 | hole 2.2: -11.582,4.75; -38.557,4.75; -25.07,-17.602
BUCKPUCK_I = drill 1.1 octagon: CTRL -8.89,2.54; LED+ -8.89,7.62; LED- -8.89,5.08; REF -8.89,0; VIN+ -8.89,-2.54; VIN- -8.89,-7.62 | hole 5.08: -2.54,-4.445
E5-10,5 = drill 1.016 pad 2.54: + -2.54,0 | drill 1.016 pad 2.54 octagon: - 2.54,0
C025-024X044 = drill 0.813 pad 1.422 octagon: 1 -1.27,0; 2 1.27,0
C0805 = smd 1.3 x 1.5: 1 -0.85,0; 2 0.85,0
E2,5-5 = drill 0.813 pad 1.6: + -1.27,0 | drill 0.813 pad 1.6 octagon: - 1.27,0
1X02_2.54_SCREWTERM = drill 1.016 square: P1 2.54,0; P2 0,0
DO41-10 = drill 1.118 pad 1.93: A 5.08,0; C -5.08,0
DIODE_SMB = smd 2.4 x 2.4: A 2.2,0; C -2.2,0
SOT23 = smd 1 x 1.4: 1 -0.95,-1.1; 2 0.95,-1.1; 3 0,1.1
SO08 = smd 0.6 x 2.2: 1 -1.905,-2.6; 2 -0.635,-2.6; 3 0.635,-2.6; 4 1.905,-2.6; 5 1.905,2.6; 6 0.635,2.6; 7 -0.635,2.6; 8 -1.905,2.6
SO14 = smd 0.66 x 2.032: 1 -3.81,-3.073; 2 -2.54,-3.073; 3 -1.27,-3.073; 4 0,-3.073; 5 1.27,-3.073; 6 2.54,-3.073; 7 3.81,-3.073; 8 3.81,3.073; 9 2.54,3.073; 10 1.27,3.073; 11 0,3.073; 12 -1.27,3.073; 13 -2.54,3.073; 14 -3.81,3.073
10X02MTA = drill 1.016 long: 1 1.27,0; 2 -1.27,0
AUDIO-JACK = drill 1.3 pad 2.184: RING 5,5; RSH 5,2.5; SLEEVE 0,0; TIP 5,-5; TSH 5,-2.5 | hole 1.2: 0,5; -2.5,5; -2.5,-5; 0,-5; 5,0
1X03 = drill 1.016 pad 1.88: 1 0,0; 2 2.54,0; 3 5.08,0
2X17 = drill 1.016 octagon: 1 -20.32,-1.27; 2 -20.32,1.27; 3 -17.78,-1.27; 4 -17.78,1.27; 5 -15.24,-1.27; 6 -15.24,1.27; 7 -12.7,-1.27; 8 -12.7,1.27; 9 -10.16,-1.27; 10 -10.16,1.27; 11 -7.62,-1.27; 12 -7.62,1.27; 13 -5.08,-1.27; 14 -5.08,1.27; 15 -2.54,-1.27; 16 -2.54,1.27; 17 0,-1.27; 18 0,1.27; 19 2.54,-1.27; 20 2.54,1.27; 21 5.08,-1.27; 22 5.08,1.27; 23 7.62,-1.27; 24 7.62,1.27; 25 10.16,-1.27; 26 10.16,1.27; 27 12.7,-1.27; 28 12.7,1.27; 29 15.24,-1.27; 30 15.24,1.27; 31 17.78,-1.27; 32 17.78,1.27; 33 20.32,-1.27; 34 20.32,1.27
POWER_JACK_PTH_BREAD = drill 1.3: GND 0,7.9; GNDBREAK 4.8,10.7; PWR 0,13.7
MOLEX-1X3 = drill 1.016 pad 1.88 square: 1 0,0 | drill 1.016 pad 1.88: 2 2.54,0; 3 5.08,0
PAK100/2500-5-34-MXP_CONNCTR = drill 1 pad 1.422: 1 20.32,-1.27; 2 20.32,1.27; 3 17.78,-1.27; 4 17.78,1.27; 5 15.24,-1.27; 6 15.24,1.27; 7 12.7,-1.27; 8 12.7,1.27; 9 10.16,-1.27; 10 10.16,1.27; 11 7.62,-1.27; 12 7.62,1.27; 13 5.08,-1.27; 14 5.08,1.27; 15 2.54,-1.27; 16 2.54,1.27; 17 0,-1.27; 18 0,1.27; 19 -2.54,-1.27; 20 -2.54,1.27; 21 -5.08,-1.27; 22 -5.08,1.27; 23 -7.62,-1.27; 24 -7.62,1.27; 25 -10.16,-1.27; 26 -10.16,1.27; 27 -12.7,-1.27; 28 -12.7,1.27; 29 -15.24,-1.27; 30 -15.24,1.27; 31 -17.78,-1.27; 32 -17.78,1.27; 33 -20.32,-1.27; 34 -20.32,1.27
DIL6-SMD = smd 1.78 x 1.52: 1 -2.54,-4.645; 2 0,-4.645; 3 2.54,-4.645; 4 2.54,4.645; 5 0,4.645; 6 -2.54,4.645
LED3MM = drill 0.813 octagon: A -1.27,0; K 1.27,0
SOT23-3 = smd 0.8 x 0.9: 1 -0.95,-1; 2 0.95,-1; 3 0,1.1
SOT23-BEC = smd 1 x 1.4: B -0.95,-1.1; C 0,1.1; E 0.95,-1.1
0805S = smd 1.016 x 1.524: 1 -0.889,0; 2 0.889,0
M1206 = smd 1.6 x 2: 1 -1.4,0; 2 1.4,0
B25P = drill 0.813 octagon: A -2.54,0; E 2.54,0; S 0,2.54
EG1213 = drill 0.7 pad 1.422: 1 -2,0; 2 0,0; 3 1.9,0 | drill 1.4 pad 2.54: MT1 -4.8,0; MT2 4.8,0
PTH-JUMPER-2-NO_NO_SILK = drill 1.016 pad 1.778: 1 -1.27,0; 2 1.27,0
SOT223 = smd 1.219 x 2.235: 1 -2.311,-3.099; 2 0,-3.099; 3 2.311,-3.099 | smd 3.6 x 2.2: 4 0,3.099
P1-17Y = drill 1.702 pad 2.121 long: TP 0,0
DPAK = smd 1.6 x 3: 1 -2.28,-5.31; 3 2.28,-5.31 | smd 4.826 x 5.715: 4 0,1.588

### Placement (x,y rotation side)
AAO_0,1  91.44,134.62 270 top
ACTV_REC  30.48,-1.27 180 top
AUDIO  53.34,134.62 270 top
BAI_0,1  110.49,134.62 270 top
BAI_2,3  129.54,134.62 270 top
BAO_0,1  72.39,134.62 270 top
BAT1  138.43,66.04 270 top
BUCKPUCK1  40.64,49.53 180 top
BUCKPUCK2  85.09,49.53 180 top
BUCKPUCK3  129.54,49.53 180 top
C1  63.5,55.88 0 top
C2  107.95,55.88 0 top
C3  152.4,55.88 0 top
C4  63.5,106.68 90 top
C5  92.71,106.68 90 top
C6  166.37,107.95 0 top
C7  153.03,106.68 270 top
C8  47.62,84.45 180 top
C9  53.98,84.45 0 top
CAMERA  49.53,5.08 90 top
CH1  181.61,17.78 90 top
CH2  181.61,27.94 90 top
CH3  181.61,38.1 90 top
D1  166.37,121.28 0 top
D2  175.26,58.42 270 top
D3  175.26,49.53 270 top
D4  109.22,110.49 90 top
D5  80.01,110.49 90 top
D_FREE1_2  68.58,5.08 90 top
D_FREE3_4  87.63,5.08 90 top
IC2  50.8,95.89 270 top
IC4  48.26,73.66 180 top
J3  181.61,56.52 90 top
J4  181.61,48.9 90 top
JP1  21.59,135.89 270 top
JP2  35.56,135.89 270 top
JP4  66.04,71.12 90 top
JP5  15.24,98.42 270 top
JP6  59.69,71.12 90 top
JP7  15.24,41.27 270 top
JP10  166.37,143.51 180 top
JP11  142.88,135.89 0 top
LED_CUE  186.69,76.2 270 top
LED_MASK  180.34,95.25 180 top
LICK  125.73,5.08 90 top
MXP-A  3.81,41.27 90 top
MXP-B  3.81,98.42 90 top
OK2  97.79,99.06 90 top
OK3  68.58,99.06 90 top
POWER_LED  181.61,111.76 0 top
Q1  101.6,110.49 90 top
Q2  109.86,97.79 180 top
Q3  72.39,110.49 90 top
Q4  80.64,97.79 180 top
Q5  59.69,46.99 90 top
Q6  66.67,42.55 90 top
Q7  104.14,46.99 90 top
Q8  111.76,41.91 90 top
Q9  148.59,46.99 90 top
Q10  156.21,41.91 90 top
R1  73.66,106.68 270 top
R2  165.1,36.2 90 top
R3  102.87,106.68 270 top
R4  162.56,51.44 90 top
R5  68.58,106.68 270 top
R6  71.12,106.68 90 top
R7  175.26,111.76 180 top
R8  76.2,97.16 270 top
R9  153.67,46.99 270 top
R10  149.86,41.91 270 top
R11  109.22,46.99 270 top
R12  105.41,41.91 270 top
R13  64.77,46.99 270 top
R14  60.96,42.55 270 top
R15  66.04,106.68 270 top
R16  78.74,104.14 270 top
R17  97.79,106.68 270 top
R18  100.33,106.68 90 top
R19  105.41,97.16 270 top
R20  95.25,106.68 270 top
R21  107.95,104.14 270 top
R22  48.9,88.9 90 top
R23  41.91,95.25 0 top
R24  43.18,91.44 270 top
R26  58.42,93.98 180 top
R27  57.78,88.9 270 top
R29  52.7,88.9 90 top
S1  182.88,123.19 90 top
SHUTTER  106.68,5.08 90 top
SJ1  106.68,89.53 180 top
SJ2  111.76,89.53 180 top
SLN  144.78,5.08 90 top
T1  167.64,55.88 0 top
T2  167.64,44.45 0 top
TP1  157.48,80.01 0 top
TP2  157.48,72.39 0 top
TP3  110.49,74.93 0 top
TP4  104.14,74.93 0 top
U$3  159.38,113.67 0 top

### Tracks (layer width: path | path; a pad name or v marks a point on that pad's centre or on a via)
+3.3V  (1 unrouted)
  Top 0.61: JP7.33 MXP-A.33 | MXP-B.33 JP5.33
+5V  (via drill 0.45)  (1 unrouted)
  Top 0.61: MXP-A.1 JP7.1 | MXP-B.1 JP5.1 | 96.52,93.34 69.22,93.34 67.31,95.25 v67.31,97.79 66.04,99.06 OK3.5 | OK2.5 95.25,99.06 96.52,97.79 96.52,93.34 | v26.67,80.01 v26.67,97.79 | 96.52,93.34 101.6,93.34 SJ1.2 | v54.61,107.95 v41.91,107.95
  Bottom 0.61: 13.97,62.23 JP7.1 13.97,69.85 24.13,80.01 v26.67,80.01 | v67.31,97.79 64.77,97.79 v54.61,107.95 | v41.91,107.95 36.83,107.95 v26.67,97.79
+9V
  Bottom 0.61: BAT1.+ 113.03,66.04 TP4.TP
  pour Top (isolate 0.61): 39.37,113.03 115.57,113.03 115.57,66.04 39.37,66.04
A_AI0
  Top 0.61: MXP-A.3 JP7.3
A_AI1
  Top 0.61: MXP-A.5 JP7.5
A_AI2
  Top 0.61: MXP-A.7 JP7.7
A_AI3
  Top 0.61: MXP-A.9 JP7.9
A_AO0
  Top 0.61: MXP-A.2 2.54,63.5 3.81,64.77 16.51,64.77 | AAO_0,1.P$SIG0 82.55,128.27 73.03,118.75 36.2,118.75 33.02,115.57 33.02,81.28 16.51,64.77 | JP7.2 16.51,64.77
A_AO1
  Top 0.406: MXP-A.4 3.81,60.33 15.24,60.33 JP7.4
  Top 0.61: AAO_0,1.P$SIG1 88.9,123.19 79.38,123.19 73.66,117.47 36.83,117.47 34.29,114.94 34.29,80.64 20.32,66.67 20.32,60.96 18.41,59.05 JP7.4
A_DIO0
  Top 0.61: MXP-A.11 JP7.11
  Bottom 0.406: MXP-A.11 6.35,48.9 7.62,47.62 7.62,15.24 7.62,12.7
  Bottom 0.61: ACTV_REC.P$SIG 10.16,10.16 7.62,12.7
A_DIO1
  Top 0.61: MXP-A.13 JP7.13
  Bottom 0.406: 8.89,13.97 8.89,42.55 12.7,46.35 JP7.13
  Bottom 0.61: CAMERA.P$SIG0 35.56,11.43 34.29,12.7 10.16,12.7 8.89,13.97
A_DIO2  (via drill 0.45)
  Top 0.61: MXP-A.15 JP7.15 | v69.85,62.23 v69.85,55.88
  Bottom 0.406: 19.05,42.55 15.24,42.55 JP7.15
  Bottom 0.61: LICK.P$SIG1 106.05,33.66 66.04,33.66 | 66.04,33.66 22.23,33.66 20.32,35.56 20.32,41.27 19.05,42.55 | JP4.2 67.31,73.66 69.85,71.12 v69.85,62.23 | v69.85,55.88 69.85,48.26 66.04,44.45 66.04,33.66
A_DIO3  (via drill 0.6)
  Top 0.61: MXP-A.17 JP7.17 | R4.1 162.56,33.02 v157.48,27.94 | v157.48,21.59 157.48,17.78 151.13,11.43 SLN.P$SIG0
  Bottom 0.406: JP7.17 12.7,41.27 12.06,40.64 12.06,19.68 13.97,17.78 15.24,17.78
  Bottom 0.61: SLN.P$SIG0 142.24,8.89 81.28,8.89 72.39,17.78 15.24,17.78 | v157.48,27.94 v157.48,21.59
A_DIO4  (via drill 0.45, 0.6)
  Top 0.406: JP7.19 15.24,40.01 19.68,40.01 | v36.83,73.66 v31.75,73.66
  Top 0.61: MXP-A.19 JP7.19 | 19.68,40.01 v24.13,35.56 31.75,27.94 v116.84,27.94
  Bottom 0.61: v116.84,27.94 130.81,13.97 130.81,11.43 LICK.P$SIG0 | v24.13,35.56 24.13,66.04 v31.75,73.66 | JP6.2 v36.83,73.66
A_DIO5
  Top 0.406: 19.05,37.47 15.24,37.47 JP7.21
  Top 0.61: 144.78,25.4 157.48,25.4 165.1,33.02 | 144.78,25.4 31.11,25.4 19.05,37.47 | MXP-A.21 JP7.21 | 165.1,32.38 165.1,33.02 | 165.1,33.02 R2.1 | SLN.P$SIG1 144.78,25.4
A_DIO6
  Top 0.406: JP7.23 15.24,32.38 19.68,32.38
  Top 0.61: MXP-A.23 JP7.23 | 19.68,32.38 28.57,23.5 92.08,23.5 104.14,11.43 SHUTTER.P$SIG0
A_DIO7
  Top 0.61: MXP-A.25 JP7.25
  Bottom 0.406: JP7.25 15.24,32.38 19.05,32.38
  Bottom 0.61: 19.05,32.38 60.96,32.38 | 60.96,32.38 61.59,32.38 | 60.96,32.38 90.17,32.38 106.68,15.88 SHUTTER.P$SIG1
A_DIO8
  Top 0.406: 20.95,27.3 15.24,27.3 JP7.27
  Top 0.61: JP7.27 MXP-A.27 | CAMERA.P$SIG1 49.53,17.78 45.72,21.59 26.67,21.59 20.95,27.3
A_DIO9
  Top 0.61: JP7.29 MXP-A.29
A_DIO10
  Top 0.61: MXP-A.31 JP7.31
  Bottom 0.406: MXP-A.31 3.81,22.23 3.81,18.41
  Bottom 0.61: 3.81,18.41 3.81,13.97 9.53,8.26 65.41,8.26 D_FREE1_2.P$SIG0
A_DIO11  (via drill 0.45)
  Top 0.406: MXP-A.18 3.81,42.55 15.24,42.55 JP7.18 20.95,41.27
  Top 0.61: 20.95,41.27 32.38,29.84 v64.14,29.84 | D_FREE1_2.P$SIG1 v68.58,21.59
  Bottom 0.61: v68.58,21.59 68.58,25.4 v64.14,29.84
A_DIO12
  Top 0.406: MXP-A.22 3.81,34.92 15.24,34.92 JP7.22
A_DIO13
  Top 0.406: MXP-A.26 3.81,29.84 15.24,29.84 JP7.26
  Bottom 0.61: D_FREE3_4.P$SIG0 92.71,11.43 93.98,12.7 93.98,15.24 78.11,31.11 66.29,31.11 66.04,31.11 JP7.26
A_DIO14
  Top 0.406: MXP-A.32 3.81,22.23 15.24,22.23 JP7.32
A_DIO15
  Top 0.406: MXP-A.34 4.45,19.05 15.24,19.05 16.51,20.32 JP7.34
  Bottom 0.61: D_FREE3_4.P$SIG1 82.55,19.05 18.41,19.05 JP7.34
A_UART.RX
  Top 0.406: JP7.10 15.24,52.7 3.81,52.7 MXP-A.10
A_UART.TX
  Top 0.406: JP7.14 15.24,47.62 3.81,47.62 MXP-A.14
AGND  (1 unrouted)
  Top 0.406: MXP-A.6 3.81,57.78 15.24,57.78 JP7.6 | MXP-B.6 3.81,114.94 15.24,114.94 JP5.6
  Bottom 0.406: 3.81,114.94 MXP-B.6 3.81,112.39
  Bottom 0.508: 3.81,114.94 6.35,114.94 | 3.81,112.39 6.99,112.39
  pour Top (isolate 0.61, no thermals): 147.32,143.51 -3.81,144.78 -3.81,66.04 38.1,66.04 38.1,114.3 147.32,114.3
  pour Bottom (isolate 0.406, no thermals): -2.54,69.85 19.05,69.85 19.05,114.3 62.87,114.3 67.31,118.11 135.89,118.11 135.89,143.51 -2.54,144.78
B_AI0  (via drill 0.6)
  Top 0.61: MXP-B.3 JP5.3 | v43.18,123.19 59.69,123.19 67.31,130.81 107.95,130.81 BAI_0,1.P$SIG0
  Bottom 0.406: 15.24,120.65 15.24,117.47 JP5.3
  Bottom 0.61: v43.18,123.19 16.51,123.19 15.24,121.92 15.24,120.65
B_AI1
  Top 0.61: MXP-B.5 JP5.5
  Bottom 0.406: JP5.5 15.24,112.39 19.05,112.39 20.32,113.67
  Bottom 0.61: BAI_0,1.P$SIG1 105.41,120.65 70.48,120.65 63.5,113.67 20.32,113.67
B_AI2
  Top 0.61: MXP-B.7 JP5.7
  Bottom 0.406: JP5.7 15.24,109.86 17.78,109.86 | 17.78,109.86 18.41,109.86 | 17.78,109.86 18.41,109.86 | 18.41,109.86 20.95,112.39
  Bottom 0.61: BAI_2,3.P$SIG0 121.28,128.27 112.39,119.38 71.12,119.38 64.14,112.39 20.95,112.39
B_AI3
  Top 0.61: MXP-B.9 JP5.9
  Bottom 0.406: JP5.9 15.24,107.31 18.41,107.31 22.23,111.12
  Bottom 0.61: 22.23,111.12 64.77,111.12 71.75,118.11 121.92,118.11 BAI_2,3.P$SIG1
B_AO0  (via drill 0.6)
  Top 0.61: MXP-B.2 2.54,120.65 3.81,121.92 15.24,121.92 16.51,120.65 JP5.2 | v43.18,120.65 60.96,120.65 68.58,128.27 BAO_0,1.P$SIG0
  Bottom 0.61: v43.18,120.65 18.41,120.65 JP5.2
B_AO1
  Top 0.406: MXP-B.4 3.81,117.47 15.24,117.47 JP5.4
  Bottom 0.61: JP5.4 18.41,118.11 61.59,118.11 67.31,123.83 70.48,123.83 BAO_0,1.P$SIG1
B_DIO0
  Top 0.61: MXP-B.11 JP5.11
B_DIO1
  Top 0.61: MXP-B.13 JP5.13
B_DIO2
  Top 0.61: MXP-B.15 JP5.15
B_DIO3
  Top 0.61: MXP-B.17 JP5.17
B_DIO4
  Top 0.61: MXP-B.19 JP5.19
B_DIO5
  Top 0.61: MXP-B.21 JP5.21
B_DIO6
  Top 0.61: MXP-B.23 JP5.23
B_DIO7
  Top 0.61: MXP-B.25 JP5.25
B_DIO8
  Top 0.61: MXP-B.27 JP5.27
B_DIO9  (via drill 0.45, 0.6)  (1 unrouted)
  Top 0.61: MXP-B.29 JP5.29 | v118.11,55.88 v118.11,84.45 133.35,99.69 v140.97,99.69 | 113.03,40.79 v113.03,38.73
  Bottom 0.406: 19.05,84.45 15.24,84.45 JP5.29
  Bottom 0.61: LED_MASK.P$SIG0 173.99,97.79 172.09,99.69 v140.97,99.69 | v118.11,55.88 113.03,50.8 v113.03,38.73 | 19.05,84.45 v118.11,84.45
B_DIO10
  Top 0.61: MXP-B.31 JP5.31
B_DIO11
  Top 0.406: JP5.18 15.24,99.69 3.81,99.69 MXP-B.18
B_DIO12  (via drill 0.45, 0.6)
  Top 0.406: MXP-B.22 3.81,92.08 15.24,92.08 JP5.22
  Top 0.61: v20.32,45.72 30.48,35.56 151.91,35.56 Q10.B 159.07,40.96 v159.38,41.27 | v20.32,71.12 20.32,89.53 JP5.22
  Bottom 0.61: v20.32,45.72 v20.32,71.12 | v159.38,41.27 175.26,57.15 LED_CUE.P$SIG
B_DIO13
  Top 0.406: JP5.26 15.24,87 3.81,87 MXP-B.26
B_DIO14  (via drill 0.45)
  Top 0.406: MXP-B.32 3.81,79.38 15.24,79.38 JP5.32
  Top 0.61: v140.97,95.25 136.53,95.25 v123.19,81.92 | Q6.B 68.9,41.59 69.85,42.55 v69.85,44.45 | v72.39,55.88 v72.39,62.23
  Bottom 0.61: JP5.32 17.78,81.92 72.39,81.92 | 72.39,81.92 v123.19,81.92 | LED_MASK.P$SIG1 v140.97,95.25 | v72.39,62.23 72.39,81.92 | v69.85,44.45 72.39,46.99 v72.39,55.88
B_DIO15
  Top 0.406: MXP-B.34 4.45,76.2 14.61,76.2 JP5.34
B_UART.RX
  Top 0.406: JP5.10 15.24,107.31 3.81,107.31 MXP-B.10
B_UART.TX
  Top 0.406: MXP-B.14 3.81,102.23 15.24,102.23 JP5.14
BCKPCK_CTRL2
  Top 0.61: R12.2 109.77,41.02 Q8.C
BCKPCK_CTRL3
  Top 0.61: R10.2 154.22,41.02 Q10.C
CTRL1
  Top 0.61: BUCKPUCK1.CTRL Q5.C
CTRL2
  Top 0.61: Q7.C BUCKPUCK2.CTRL
CTRL3
  Top 0.61: BUCKPUCK3.CTRL Q9.C
DGND  (14 unrouted)
  Top 0.254: R15.1 66.04,107.54 64.21,107.54 63.98,107.77 63.52,107.77 C4.2 | R20.1 95.25,107.54 93.42,107.54 93.19,107.77 92.73,107.77 C5.2
  Top 0.406: MXP-A.30 3.81,24.77 15.24,24.77 | MXP-B.8 3.81,112.39 15.24,112.39 JP5.8
  Bottom 0.61: 92.71,114.3 C5.2 | C4.2 64.77,107.95 71.12,114.3 | SJ2.1 116.84,89.53
  pour Bottom (isolate 0.406, rank 2, no thermals): -8.89,-5.08 190.5,-3.81 190.5,142.24 137.16,143.51 137.16,116.84 71.12,116.84 71.12,83.82 12.7,83.82 12.7,68.58 -7.62,68.58
  pour Top (isolate 0.61, rank 2, no thermals): -3.81,-3.81 -3.81,64.77 116.84,64.77 116.84,123.19 138.43,123.19 138.43,143.51 191.77,143.51 191.77,-3.81
GND-ISO  (via drill 0.45, 0.45 pad 0.9)
  Top 0.254: D5.1 81.13,109.37 81.13,105.03 81.36,104.8 81.36,104.34 R16.S | R16.E 78.16,101.6 77.24,100.69 76.1,100.69 74.5,99.08 73.36,99.08 OK3.2 | D4.1 110.34,109.37 110.34,105.03 110.57,104.8 110.57,104.34 R21.S | R21.E 107.37,101.6 106.45,100.69 105.31,100.69 103.71,99.08 102.56,99.08 OK2.2
  Top 0.406: IC2.4 v45.72,93.98 45.72,91.44 44.83,90.55 | 44.83,90.55 R24.2 | 44.45,84.45 IC4.7 | 44.45,84.45 44.45,90.17 44.83,90.55 | C8.2 44.45,84.45 | C9.2 57.78,87.42 R27.2 60.07,88.01 v60.96,88.9
  Top 0.61: JP11.3 147.96,130.81 135.25,118.11 113.67,118.11 111.76,116.2 v111.76,114.94 | SJ2.2 TP3.TP
  Bottom 0.254: R21.S 110.34,104.11 107.82,101.6 R21.E
  Bottom 0.61: 110.49,109.22 111.76,110.49 v111.76,114.94 | TP3.TP 129.54,74.93 BAT1.-
  pour Bottom (isolate 0.406): 115.57,85.09 17.78,85.09 17.78,113.03 115.57,113.03
LED3+
  Bottom 0.61: CH3.P1 176,40.64 174.58,39.22 141.12,39.22 BUCKPUCK3.LED+
LICK1  (via drill 0.45)
  Top 0.254: Q1.1 102.56,109.37 102.56,107.77 102.79,107.54 R3.1 | 108.28,110.52 D4.3
  Top 0.406: IC2.2 45.72,96.52 44.45,97.79 v44.45,100.33 | v83.82,95.89 90.17,102.23 90.17,109.22 91.44,110.49 v96.52,110.49 | D4.3 108.12,110.03 105.41,107.31 103.12,107.31 R3.1 | Q1.1 104.45,109.54 v104.78,109.22
  Top 0.61: 108.28,110.52 108.28,114.63 113.03,119.38 134.62,119.38 142.88,127.64 JP11.1
  Bottom 0.406: v44.45,100.33 57.15,100.33 61.59,95.89 v83.82,95.89 | v104.78,109.22 97.79,109.22 v96.52,110.49
LICK1_CIRCUIT1  (via drill 0.45)
  Top 0.254: R20.2 95.25,105.72 93.65,105.72 93.42,105.49 92.73,105.49 C5.1 92.73,105.26 | 93.19,101.6 OK2.4
  Top 0.406: OK2.4 v95.89,101.6
  Top 0.61: JP4.1 78.11,71.12 v95.89,88.9
  Bottom 0.406: v95.89,101.6 95.89,102.23 C5.1
  Bottom 0.61: v95.89,88.9 v95.89,101.6
LICK1_CIRCUIT2  (via drill 0.45)
  Top 0.406: IC4.4 v48.26,78.74
  Bottom 0.61: JP4.3 62.23,80.01 49.53,80.01 v48.26,78.74
LICK2  (via drill 0.45)
  Top 0.254: Q3.1 73.36,109.37 73.36,107.77 73.58,107.54 R1.1 73.81,107.54 74.95,107.54 77.24,109.83 77.24,110.06 77.7,110.52 78.84,110.52 D5.3
  Top 0.406: IC2.6 55.88,95.25 v57.15,96.52 | v87.63,109.22 87.63,114.3
  Top 0.61: D5.3 78.74,110.66 78.74,113.03 80.01,114.3 87.63,114.3 106.05,114.3 112.39,120.65 132.08,120.65 v133.35,121.92
  Bottom 0.406: v57.15,96.52 59.69,93.98 86.36,93.98 87.63,95.25 v87.63,109.22
  Bottom 0.61: v133.35,121.92 145.41,133.99 JP11.2
LICK2_CIRCUIT1  (via drill 0.45, 0.45 pad 0.9)
  Top 0.254: R15.2 66.04,105.72 64.44,105.72 64.21,105.49 63.52,105.49 C4.1 63.52,105.26 63.52,104.8 | OK3.4 63.98,101.6
  Top 0.61: v67.31,101.6 OK3.4 62.87,101.6 61.59,100.33 61.59,93.98 v63.5,92.08 | JP6.1 62.23,71.12 62.87,71.75 62.87,87 v63.5,87.63
  Bottom 0.61: v67.31,101.6 C4.1 | v63.5,87.63 v63.5,92.08
LICK2_CIRCUIT2  (via drill 0.45)
  Top 0.406: IC4.2 v50.8,78.74
  Bottom 0.61: JP6.3 53.34,76.2 v50.8,78.74
N$1
  Top 0.254: Q1.3 100.51,110.29 100.51,107.77 R18.2 100.28,107.54 97.99,107.54 R17.1
N$2
  Top 0.61: T2.1 165.1,41.12 R2.2
N$3
  Bottom 0.61: JP1.SLEEVE 24.13,133.35 35.56,133.35 | 35.56,133.35 43.18,133.35 45.72,130.81 50.8,130.81 | JP2.SLEEVE 35.56,133.35 | AUDIO.P$GND1 55.88,129.54 54.61,130.81 50.8,130.81 | AUDIO.P$GND0 50.8,130.81
N$4
  Top 0.61: JP1.RING 26.59,129.62 27.94,128.27 40.64,128.27 | 40.64,128.27 AUDIO.P$SIG0 | JP2.RING 40.56,128.35 40.64,128.27
N$5
  Top 0.61: JP1.TIP 16.59,132.16 17.78,133.35 29.21,133.35 30.48,132.08 30.48,130.97 JP2.TIP
  Bottom 0.61: JP2.TIP 30.56,128.19 31.75,127 45.72,127 49.53,123.19 52.07,123.19 53.34,124.46 AUDIO.P$SIG1
N$6
  Top 0.61: T1.1 165.28,52.84 R4.2
N$7
  Top 0.254: Q3.3 71.3,110.29 71.3,107.77 R6.2 71.07,107.54 68.78,107.54 R5.1
N$8  (via drill 0.45)
  Top 0.254: 70.84,105.49 71.07,105.72 R6.1 | 81.58,99.08 Q4.B
  Top 0.406: Q4.B 81.59,100.64 v81.92,100.97 | v70.48,102.23 70.48,104.14 71.12,104.78 R6.1
  Bottom 0.406: v81.92,100.97 81.92,100.33 80.64,99.06 73.66,99.06 v70.48,102.23
N$9
  Top 0.254: R8.2 76.1,96.34 73.36,96.34 OK3.1
N$10
  Top 0.254: Q4.C 80.44,96.8 78.84,96.8 77.47,98.17 76.33,98.17 R8.1
N$11
  Top 0.61: BUCKPUCK3.REF 148.1,49.53 Q9.E 153.61,47.94 R9.1
N$12  (via drill 0.61)
  Top 0.254: v74.73,111.43 73.58,111.43 Q3.2
  Bottom 0.406: v74.73,111.43 74.73,110.69 R16.A
N$13  (via drill 0.45)
  Top 0.61: BUCKPUCK1.LED+ 55.88,41.91 59.69,38.1 v68.58,38.1
  Bottom 0.61: CH1.P1 180.34,20.32 179.07,19.05 129.54,19.05 113.67,34.92 71.75,34.92 v68.58,38.1
N$14  (via drill 0.45)
  Top 0.254: 100.05,105.49 100.28,105.72 R18.1 | 110.8,99.08 Q2.B
  Top 0.406: Q2.B 110.81,100.64 v111.12,100.97 | v99.06,101.6 99.69,102.23 99.69,104.78 100.33,105.41 R18.1
  Bottom 0.406: v111.12,100.97 109.22,99.06 104.14,99.06 101.6,101.6 v99.06,101.6
N$15
  Top 0.61: R9.2 153.61,46.04 Q9.B 149.69,42.97 R10.1
N$16
  Top 0.61: C1.+ 60.96,52.07 | C2.+ 105.41,52.07 | C7.+ 149.86,107.95
  Top 1.016: 149.86,107.95 C3.+ 146.05,52.07 BUCKPUCK3.VIN+ 135.2,52.07 133.55,50.42 130.61,50.42 128.96,52.07 105.41,52.07 BUCKPUCK2.VIN+ 90.75,52.07 89.1,50.42 86.16,50.42 84.51,52.07 60.96,52.07 BUCKPUCK1.VIN+ | 149.86,107.95 149.86,118.11 153.03,121.28 D1.C | U$3.1 156.99,107.95 149.86,107.95
N$17
  Top 0.254: R19.2 105.31,96.34 102.56,96.34 OK2.1
N$18
  Top 0.254: Q2.C 109.65,96.8 108.05,96.8 106.68,98.17 105.54,98.17 R19.1
N$19  (via drill 0.61)
  Top 0.254: v103.94,111.43 102.79,111.43 Q1.2
  Bottom 0.254: R21.A 107.82,106.86
  Bottom 0.406: v103.94,111.43 105.74,111.43 107.95,109.22 R21.A
N$20
  Bottom 0.61: BUCKPUCK2.LED+ 99.69,36.2 116.2,36.2 121.92,30.48 CH2.P1
N$21
  Top 0.61: POWER_LED.A R7.1
N$22
  Top 0.61: BUCKPUCK1.REF 59.2,49.53 Q5.E 64.71,47.94 R13.1
N$23
  Top 0.406: 49.53,80.01 IC4.3 49.53,82.55 48.48,83.61 C8.1 48.48,87.59 R22.1
N$24
  Top 0.61: BUCKPUCK2.REF 103.65,49.53 Q7.E 109.16,47.94 R11.1
N$25
  Top 0.406: R22.2 48.9,90.81 50.16,92.08 50.16,97.16 49.53,97.79 IC2.1
N$26
  Top 0.406: IC2.3 R23.2 43.18,94.87 R24.1
N$29
  Top 0.61: R13.2 64.71,46.04 Q5.B 60.79,43.6 R14.1
N$31
  Top 0.406: IC2.5 R26.2 57.53,90.04 R27.1
N$33
  Top 0.61: R11.2 109.16,46.04 Q7.B 105.24,42.97 R12.1
N$34
  Top 0.406: 52.07,80.01 IC4.1 52.07,80.54 53.12,81.6 C9.1 53.12,87.59 R29.1
N$35
  Top 0.406: R29.2 52.7,90.81 51.44,92.08 51.44,95.89 52.07,96.52 IC2.7
N$36
  Top 1.016: S1.2 172.72,123.19 166.37,129.54 JP10.PWR
N$42
  Top 0.61: R14.2 64.69,41.66 Q6.C
VCC
  Top 0.61: U$3.3 162.07,107.95 C6.1 165.74,108.17 165.74,109.86 167.64,111.76 R7.2
  Top 1.016: U$3.3 161.93,108.09 161.93,72.39 | D3.C 180.04,51.73 J4.1 | J3.1 178.78,60.62 D2.C 173.69,60.62 161.93,72.39 | TP2.TP 161.93,72.39
  Bottom 1.016: J4.1 179.07,50.16 177.8,51.44 177.8,56.52 179.07,57.78 J3.1
VIN
  Top 1.016: S1.1 171.99,121.19 D1.A
VOUT-1
  Top 0.61: T1.2 T1.4
  Top 1.016: J3.2 176.24,55.24 D2.A 170.4,56.22 T1.4
VOUT-2
  Top 0.61: T2.4 T2.2
  Top 1.016: 175.26,47.62 J4.2 | 175.26,47.62 167.72,47.62 T2.4 | D3.A 175.26,47.62

### Text on the board
tPlace: L1 | L2 | GND | 5V | AO0 | AI0 | AO1 | AI1 | AGND | AI2 | AI3 | UART.RX | DIO0 | DIO1 | UART.TX | DIO2 | DIO3 | DIO11 | DIO4 | DIO5 | DIO12 | +5V | +9V | 9VG | DGND | DIO6 | DIO7 | DIO13 | DIO8 | DIO9 | DIO10 | DIO14 | DGND | L2 C2 | L1 C2 | 3.3V | DIO15 | V_soln | +9V | 9VG | L2 C1 | L1 C1 | 5V | AO0 | AI0 | AO1 | +9V | AI1 | AGND | AI2 | AI3 | UART.RX | DIO0 | DIO1 | UART.TX | DIO2 | DIO3 | DIO11 | + | DIO4 | LED 3 | DIO5 | DIO12 | DIO6 | DIO7 | DIO13 | + | A_DIO3 / A_DIO5 | DIO8 | LED 2 | DIO9 | DIO10 | DIO14 | 3.3V | DIO15 | + | LED 1 | A_DIO1 / A_DIO8 | A_DIO10 / A_DIO11 | A_DIO13 / A_DIO15 | A_DIO6 / A_DIO7 | A_DIO4 / A_DIO2 | A_DIO0 | HMS Inst Core / NI MyRIO Expansion Rev. 3 / PVG 5/2017
tNames: For non-isolated use, / jumper and remove / battery | Alternate lick detection. / Non-isolated use only / Jumper to specify / circuit used